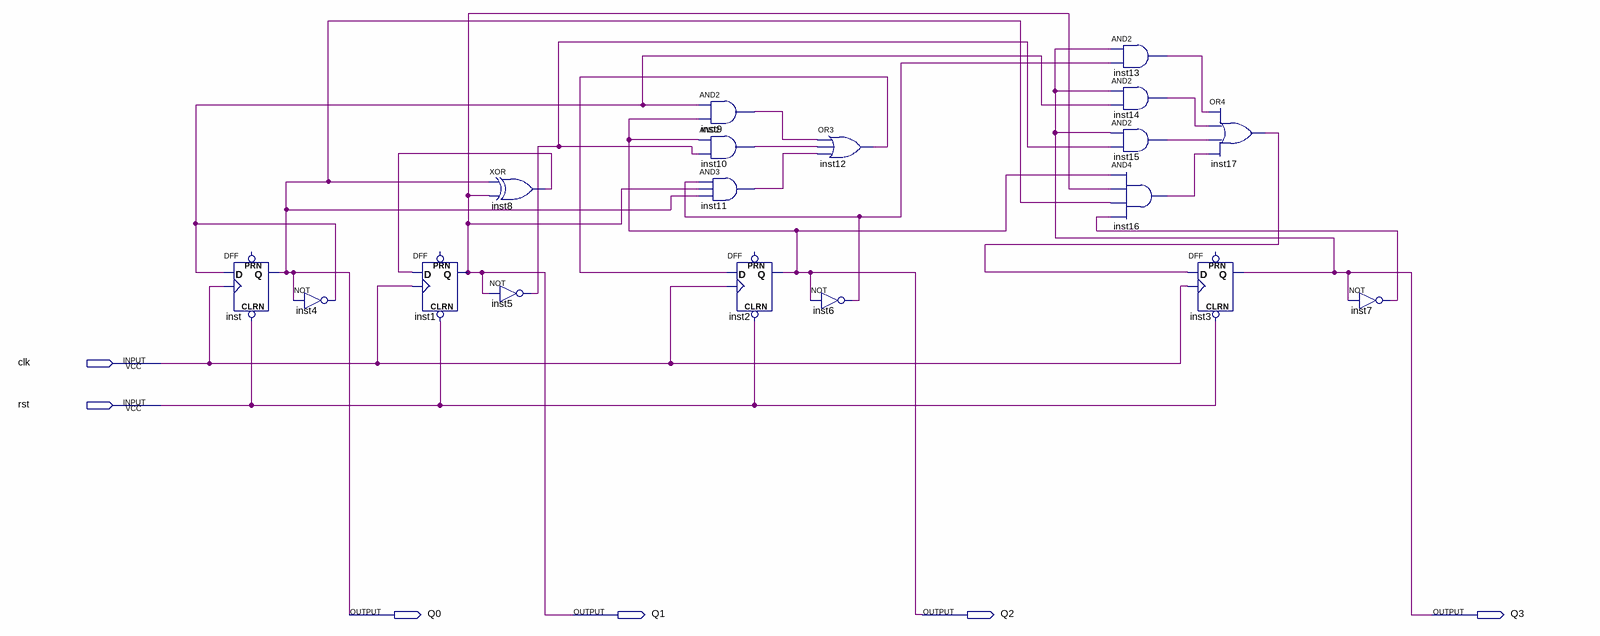
[diagram p0: schematic sheet]
// Quartus schematic count16.bdf as structural Verilog: 18 symbols, 6 pins
module count16 (
  input  clk,
  input  rst,
  output Q0,
  output Q1,
  output Q2,
  output Q3
);

  wire inst4_out, inst5_out, inst6_out, inst7_out, inst8_out, inst9_out, inst10_out, inst11_out, inst12_out,
       inst13_out, inst14_out, inst15_out, inst16_out, inst17_out;

  DFF inst (.CLRN(rst), .CLK(clk), .D(inst4_out), .Q(Q0));  // open: PRN
  not inst4 (inst4_out, Q0);
  DFF inst1 (.CLRN(rst), .CLK(clk), .D(inst8_out), .Q(Q1));  // open: PRN
  xor inst8 (inst8_out, Q0, Q1);
  not inst5 (inst5_out, Q1);
  and inst9 (inst9_out, inst4_out, Q2);
  and inst10 (inst10_out, Q2, inst5_out);
  and inst11 (inst11_out, inst6_out, Q1, Q0);
  DFF inst2 (.CLRN(rst), .CLK(clk), .D(inst12_out), .Q(Q2));  // open: PRN
  or inst12 (inst12_out, inst9_out, inst10_out, inst11_out);
  not inst6 (inst6_out, Q2);
  and inst13 (inst13_out, Q3, inst6_out);
  and inst14 (inst14_out, Q3, inst4_out);
  and inst15 (inst15_out, Q3, inst5_out);
  and inst16 (inst16_out, Q2, Q1, Q0, inst7_out);
  DFF inst3 (.CLRN(rst), .CLK(clk), .D(inst17_out), .Q(Q3));  // open: PRN
  or inst17 (inst17_out, inst13_out, inst14_out, inst15_out, inst16_out);
  not inst7 (inst7_out, Q3);
endmodule
